# Altium schematic sheet dsau-interfaces.SchDoc: dSAU Motherboard - LEDs/Switches
size Letter; Engineer: Christopher J. Woodall; Organization: Boston University EDF/ECE; DocumentNumber: 10; Revision: A; SheetNumber: 10; SheetTotal: 10; EMAIL: cwoodall@bu.edu; TeamName: Team 19; ProjectName: dSAU
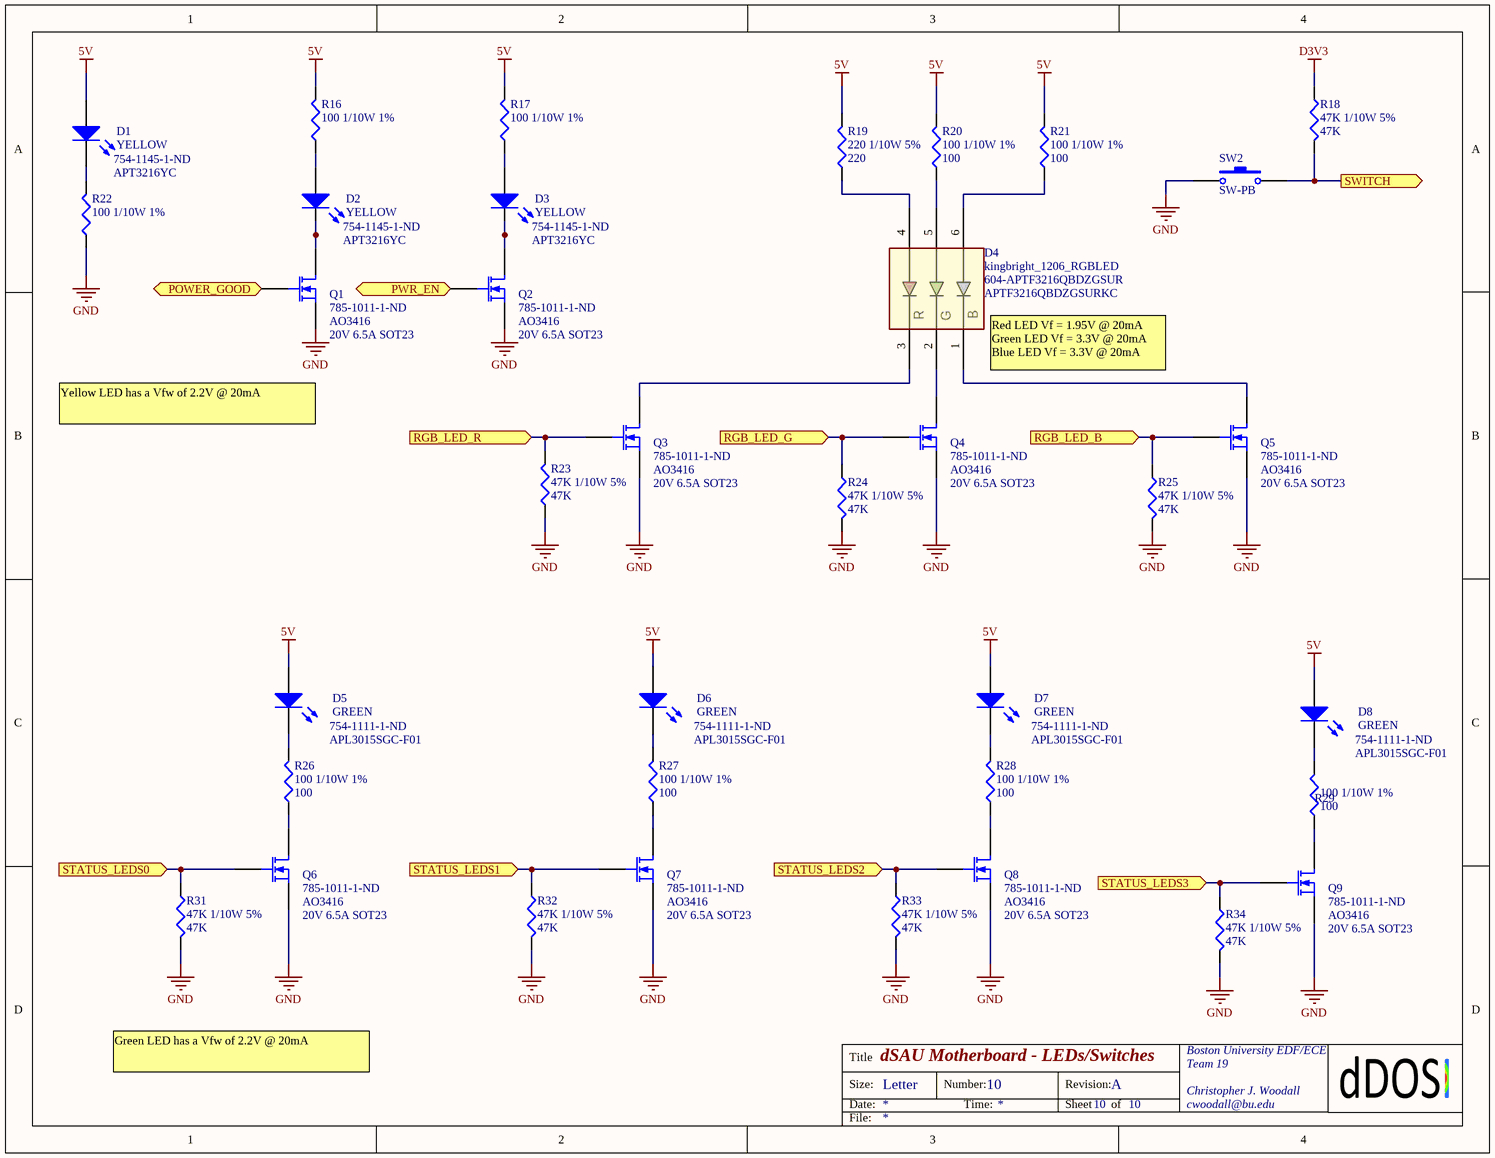
[diagram p0: dsau-interfaces.SchDoc]

## Parts
D1  YELLOW  Manufacturer Part Number: APT3216YC  Supplier Part Number 1: 754-1145-1-ND  [LED3216X08M]
D2  YELLOW  Manufacturer Part Number: APT3216YC  Supplier Part Number 1: 754-1145-1-ND  [LED3216X08M]
D3  YELLOW  Manufacturer Part Number: APT3216YC  Supplier Part Number 1: 754-1145-1-ND  [LED3216X08M]
D4  kingbright_1206_RGBLED  Supplier Part Number 1: 604-APTF3216QBDZGSUR  Manufacturer Part Number: APTF3216QBDZGSURKC  [RGBLED_1206_KINGSBRIGHT]
D5  GREEN  Manufacturer Part Number: APL3015SGC-F01  Supplier Part Number 1: 754-1111-1-ND  [LED3216X08M]
D6  GREEN  Manufacturer Part Number: APL3015SGC-F01  Supplier Part Number 1: 754-1111-1-ND  [LED3216X08M]
D7  GREEN  Manufacturer Part Number: APL3015SGC-F01  Supplier Part Number 1: 754-1111-1-ND  [LED3216X08M]
D8  GREEN  Manufacturer Part Number: APL3015SGC-F01  Supplier Part Number 1: 754-1111-1-ND  [LED3216X08M]
Q1  20V 6.5A SOT23  Manufacturer Part Number: AO3416  Supplier Part Number 1: 785-1011-1-ND  [SOT95P305X200-3M]
Q2  20V 6.5A SOT23  Manufacturer Part Number: AO3416  Supplier Part Number 1: 785-1011-1-ND  [SOT95P305X200-3M]
Q3  20V 6.5A SOT23  Manufacturer Part Number: AO3416  Supplier Part Number 1: 785-1011-1-ND  [SOT95P305X200-3M]
Q4  20V 6.5A SOT23  Manufacturer Part Number: AO3416  Supplier Part Number 1: 785-1011-1-ND  [SOT95P305X200-3M]
Q5  20V 6.5A SOT23  Manufacturer Part Number: AO3416  Supplier Part Number 1: 785-1011-1-ND  [SOT95P305X200-3M]
Q6  20V 6.5A SOT23  Manufacturer Part Number: AO3416  Supplier Part Number 1: 785-1011-1-ND  [SOT95P305X200-3M]
Q7  20V 6.5A SOT23  Manufacturer Part Number: AO3416  Supplier Part Number 1: 785-1011-1-ND  [SOT95P305X200-3M]
Q8  20V 6.5A SOT23  Manufacturer Part Number: AO3416  Supplier Part Number 1: 785-1011-1-ND  [SOT95P305X200-3M]
Q9  20V 6.5A SOT23  Manufacturer Part Number: AO3416  Supplier Part Number 1: 785-1011-1-ND  [SOT95P305X200-3M]
R16  100 1/10W 1%  [RESC1608L]
R17  100 1/10W 1%  [RESC1608L]
R18  47K 1/10W 5%  value 47K  [RESC1608L]
R19  220 1/10W 5%  value 220  [RESC1608L]
R20  100 1/10W 1%  value 100  [RESC1608L]
R21  100 1/10W 1%  value 100  [RESC1608L]
R22  100 1/10W 1%  [RESC1608L]
R23  47K 1/10W 5%  value 47K  [RESC1608L]
R24  47K 1/10W 5%  value 47K  [RESC1608L]
R25  47K 1/10W 5%  value 47K  [RESC1608L]
R26  100 1/10W 1%  value 100  [RESC1608L]
R27  100 1/10W 1%  value 100  [RESC1608L]
R28  100 1/10W 1%  value 100  [RESC1608L]
R29  100 1/10W 1%  value 100  [RESC1608L]
R31  47K 1/10W 5%  value 47K  [RESC1608L]
R32  47K 1/10W 5%  value 47K  [RESC1608L]
R33  47K 1/10W 5%  value 47K  [RESC1608L]
R34  47K 1/10W 5%  value 47K  [RESC1608L]
SW2  SW-PB  [SPST_SW_FSM4JH]

## Ports
POWER_GOOD (in), PWR_EN (in), RGB_LED_B (in), RGB_LED_G (in), RGB_LED_R (in), STATUS_LEDS0 (in), STATUS_LEDS1 (in), STATUS_LEDS2 (in), STATUS_LEDS3 (in), SWITCH (out)

## Nets
5V: D1.1(A) D5.1(A) D6.1(A) D7.1(A) D8.1(A) R16.2 R17.2 R19.2 R20.2 R21.2
D3V3: R18.1
GND: Q1.2(S) Q2.2(S) Q3.2(S) Q4.2(S) Q5.2(S) Q6.2(S) Q7.2(S) Q8.2(S) Q9.2(S) R22.1 R23.1 R24.2 R25.2 R31.2 R32.2 R33.2 R34.2 SW2.2
POWER_GOOD: Q1.1(G) ; port POWER_GOOD
PWR_EN: Q2.1(G) ; port PWR_EN
RGB_LED_B: Q5.1(G) R25.1 ; port RGB_LED_B
RGB_LED_G: Q4.1(G) R24.1 ; port RGB_LED_G
RGB_LED_R: Q3.1(G) R23.2 ; port RGB_LED_R
STATUS_LEDS0: Q6.1(G) R31.1 ; port STATUS_LEDS0
STATUS_LEDS1: Q7.1(G) R32.1 ; port STATUS_LEDS1
STATUS_LEDS2: Q8.1(G) R33.1 ; port STATUS_LEDS2
STATUS_LEDS3: Q9.1(G) R34.1 ; port STATUS_LEDS3
SWITCH: R18.2 SW2.1 ; port SWITCH
NetD1_2: D1.2(K) R22.2
NetD2_1: D2.1(A) R16.1
NetD2_2: D2.2(K) Q1.3(D)
NetD3_1: D3.1(A) R17.1
NetD3_2: D3.2(K) Q2.3(D)
NetD4_1: D4.1(B_N) Q5.3(D)
NetD4_2: D4.2(G_N) Q4.3(D)
NetD4_3: D4.3(R_N) Q3.3(D)
NetD4_4: D4.4(R_P) R19.1
NetD4_5: D4.5(G_P) R20.1
NetD4_6: D4.6(B_P) R21.1
NetD5_2: D5.2(K) R26.2
NetD6_2: D6.2(K) R27.2
NetD7_2: D7.2(K) R28.2
NetD8_2: D8.2(K) R29.2
NetQ6_3: Q6.3(D) R26.1
NetQ7_3: Q7.3(D) R27.1
NetQ8_3: Q8.3(D) R28.1
NetQ9_3: Q9.3(D) R29.1

## Notes on the sheet
- (near D4) Red LED Vf = 1.95V @ 20mA
  Green LED Vf = 3.3V @ 20mA
  Blue LED Vf = 3.3V @ 20mA
- Yellow LED has a Vfw of 2.2V @ 20mA
- Green LED has a Vfw of 2.2V @ 20mA
- Title
- Size:
- Date:
- Letter
- Number:
- Time:
- Revision:
- Sheet
- of
- File:
- (in symbol kingbright_1206_RGBLED) R; G; B

## Library data of the parts
D1-D3 D5-D8 = LED0: Typical INFRARED GaAs LED; Manufacturer: Kingbright Company LLC; Published: 8-Jun-2000; LatestRevisionDate: 08-Jul-2005; LatestRevisionNote: Mech Layer 1 removed.; PackageReference: LED-0; Publisher: Altium Limited; Supplier 1: Digi-Key
D4 = kingbright_1206_RGBLED: The Blue source color devices are made with InGaN Light     Emitting Diode.     The Green source color devices are made with InGaN     on Sapphire Light Emitting Diode.     The Hyper Red source color devices are made with Al-  GaInP on GaAs substrate Ligh; Supplier 1: Mouser; Manufacturer: Kingbright
Q1-Q9 = MOSFET-N: N-Channel MOSFET 1.8V Logic Level; Manufacturer: Alpha & Omega Semiconductor Inc; Value: AO3416; Published: 8-Jun-2000; LatestRevisionDate: 17-Jul-2002; LatestRevisionNote: Re-released for DXP Platform.; PackageVersion: 1995/1996; PackageReference: E3; Publisher: Altium Limited; Supplier 1: Digi-Key
R16 R17 R22 = Res3: Resistor; Manufacturer: Yageo; Manufacturer Part Number: RC0603FR-07100RL; Value: 470; Published: 8-Jun-2000; LatestRevisionDate: 29-May-2009; LatestRevisionNote: IPC-7351 Footprint Added.; PackageReference: J1-0603; Publisher: Altium Limited; PackageDescription: Chip Resistor; Supplier 1: Digi-Key; Supplier Part Number 1: 311-100HRCT-ND
R18 R23-R25 R31-R34 = Res3: Resistor; Manufacturer: Yageo; Manufacturer Part Number: 311-47kGRCT-ND; Published: 8-Jun-2000; LatestRevisionDate: 29-May-2009; LatestRevisionNote: IPC-7351 Footprint Added.; PackageReference: J1-0603; Publisher: Altium Limited; PackageDescription: Chip Resistor; Supplier 1: Digi-Key; Supplier Part Number 1: 311-47KGRTR-ND
R19 = Res3: Resistor; Manufacturer: Yageo; Manufacturer Part Number: RC0603FR-07220RL; Published: 8-Jun-2000; LatestRevisionDate: 29-May-2009; LatestRevisionNote: IPC-7351 Footprint Added.; PackageReference: J1-0603; Publisher: Altium Limited; PackageDescription: Chip Resistor; Supplier 1: Digi-Key; Supplier Part Number 1: 311-220HRCT-ND
R20 R21 R26-R29 = Res3: Resistor; Manufacturer: Yageo; Manufacturer Part Number: RC0603FR-07100RL; Published: 8-Jun-2000; LatestRevisionDate: 29-May-2009; LatestRevisionNote: IPC-7351 Footprint Added.; PackageReference: J1-0603; Publisher: Altium Limited; PackageDescription: Chip Resistor; Supplier 1: Digi-Key; Supplier Part Number 1: 311-100HRCT-ND
SW2 = SW-PB: Switch; Manufacturer: TE Connectivity; Manufacturer Part Number: FSM4JH; Published: 24-Mar-1999; LatestRevisionDate: 17-Jul-2002; LatestRevisionNote: Re-released for DXP Platform.; PackageReference: SPST-2; Publisher: Altium Limited; Supplier 1: Digi-Key; Supplier Part Number 1: 450-1650-ND